# EAGLE board TK90X (EAGLE 7.4.0), part 1 of 2
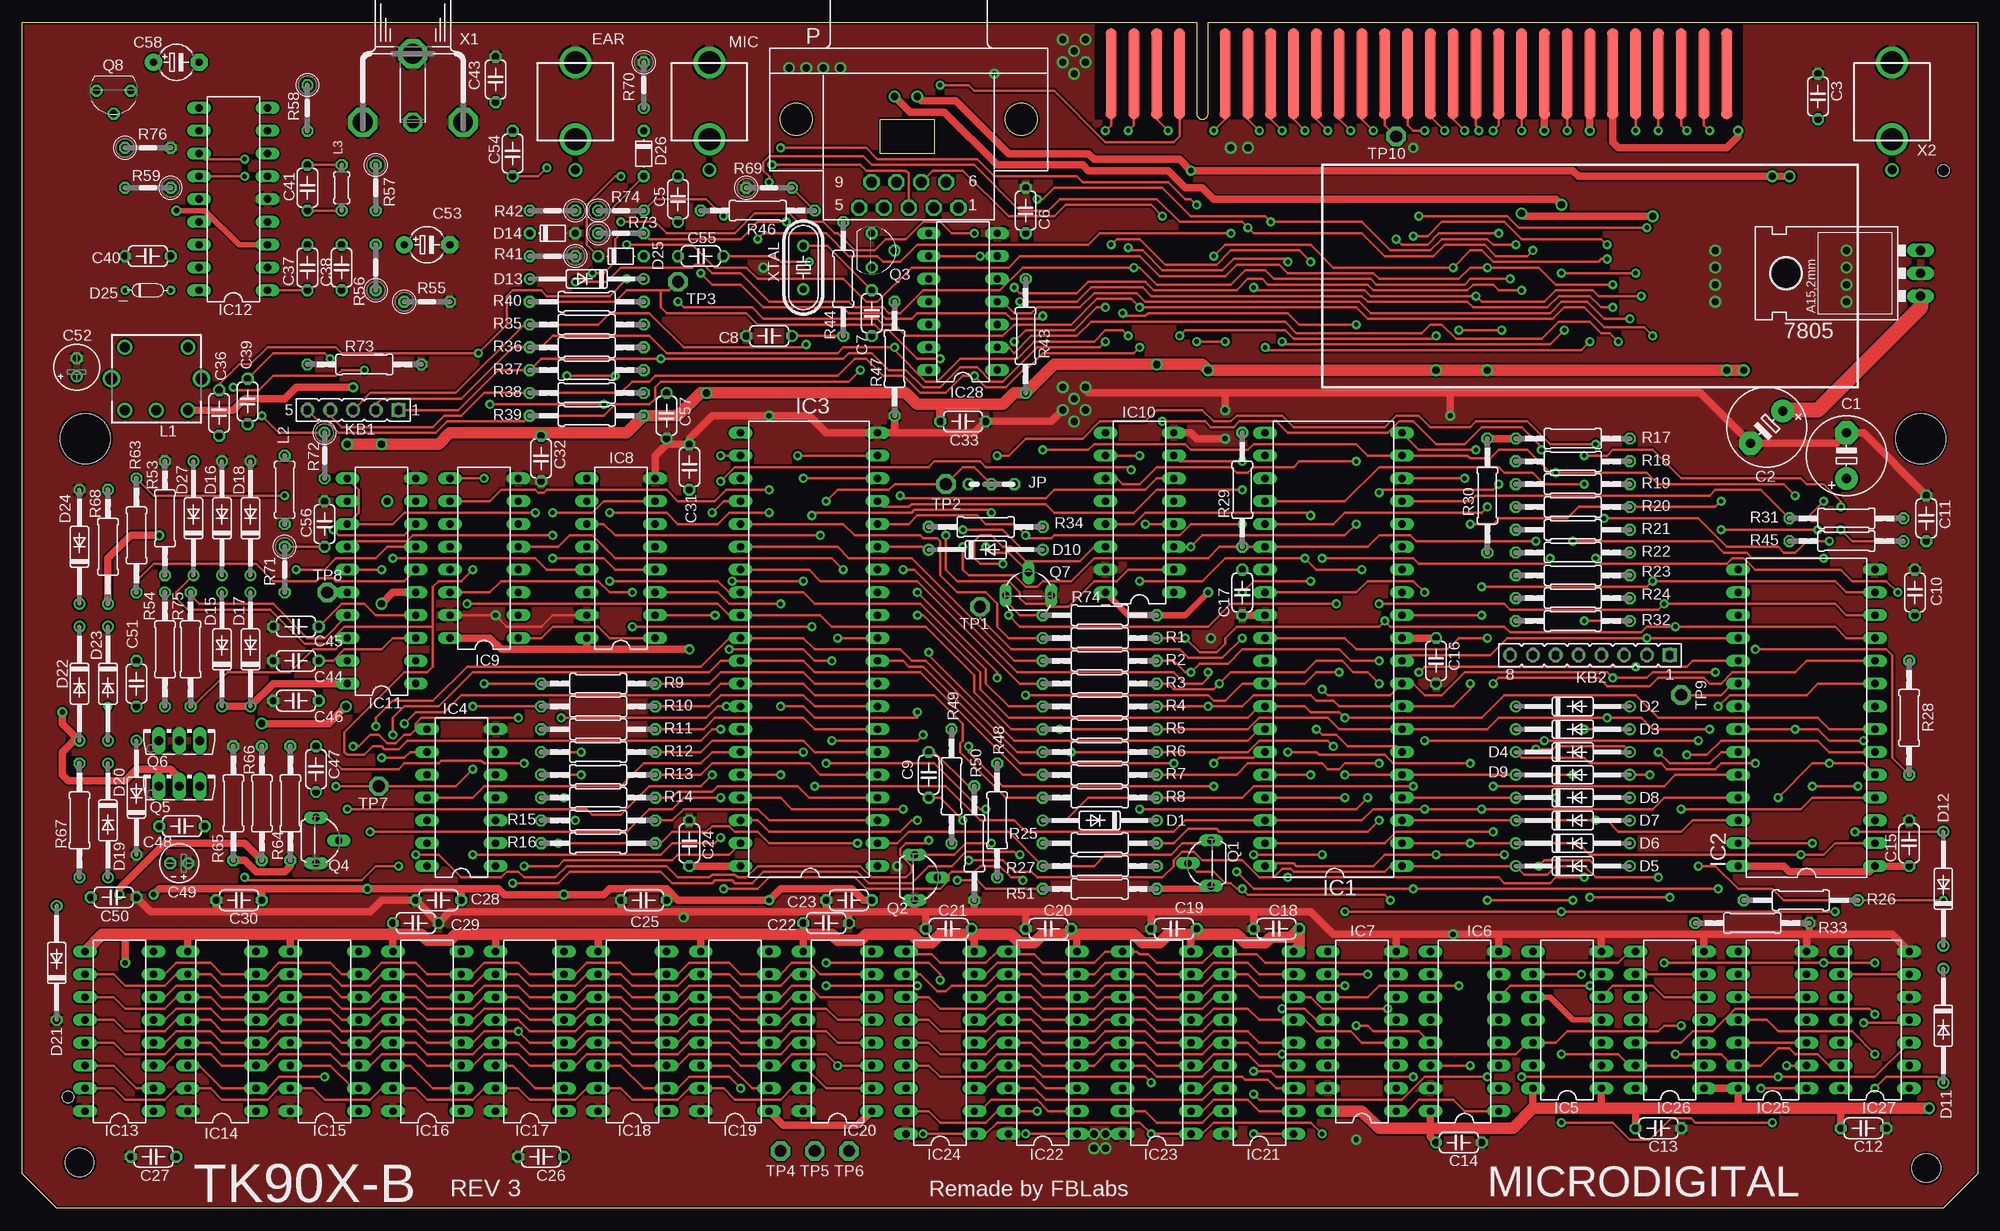
[diagram p5: board, top side]
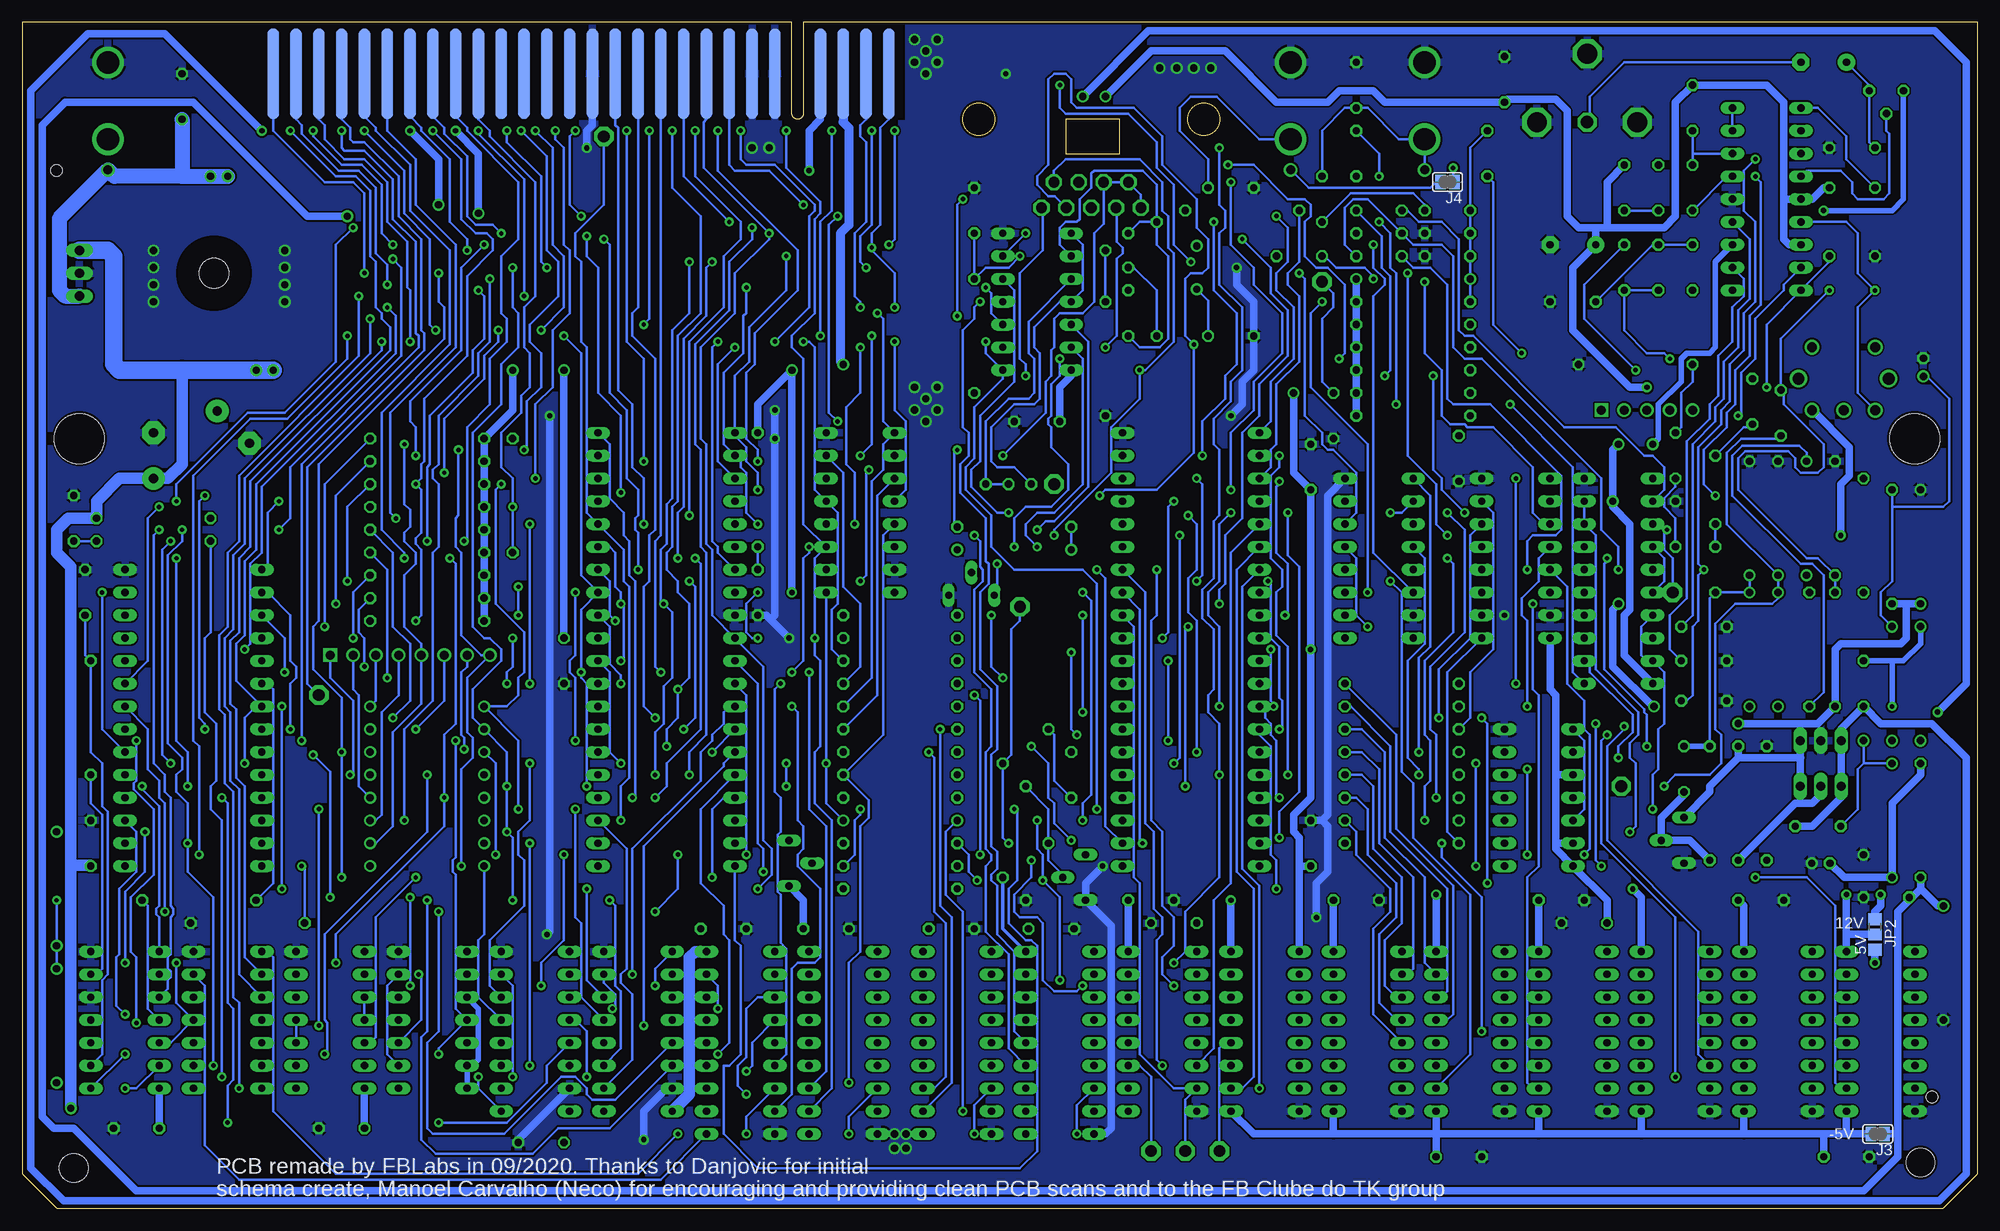
[diagram p6: board, bottom side, seen from below]

Size 217.81 x 132.08 mm. Coordinates in mm from the lower left corner, seen from the top.
Outline: 120.02,132.08 0,132.08 0,3.81 3.81,0 214,0 217.81,3.81 217.81,132.08 191.13,132.08
Copper layers (1*16): Top 0.035mm / dielectric 1.5mm / Bottom 0.035mm
Design rules "SparkFun(8mil) *": minimum track width 10mil, minimum drill 18mil, track to track 8mil, track to pad 8mil, pad to pad 8mil, via to via 8mil, smd to smd 8mil, copper to edge 10mil, drill to drill 8mil, minimum pad ring 10mil, minimum via ring 10mil, stop-mask expansion 4mil, vias tented up to drill 25mil, thermal gap 10mil
Net classes: 1 power: width 0.711 mm, drill 0.508 mm
Holes 3.2 mm at 6.35,5.08 212.09,4.45
Holes 5.59 mm at 6.99,85.72 211.46,85.72
Holes 1.3 mm at 5.08,12.38 214,115.57

## Footprints (pad centres in the part's own frame; a part is rotated, then mirrored left to right if it is on the bottom)
78XXL = drill 1.016 long: GND 0,-3.81; IN -2.54,-3.81; OUT 2.54,-3.81 | hole 3.302: 0,11.176
E5-8,5 = drill 1.016 pad 2.54: + -2.54,0 | drill 1.016 pad 2.54 octagon: - 2.54,0
C050-024X044 = drill 0.813 octagon: 1 -2.54,0; 2 2.54,0
E2-4 = drill 0.813 pad 1.27: + -1.016,0 | drill 0.813 pad 1.27 octagon: - 1.016,0
E2-5 = drill 0.813 pad 1.27: + -1.016,0 | drill 0.813 pad 1.27 octagon: - 1.016,0
E5-4 = drill 0.813 pad 1.905: + -2.54,0 | drill 0.813 pad 1.905 octagon: - 2.54,0
DO35-12 = drill 0.813: A 6.35,0; C -6.35,0
D-5 = drill 0.813 octagon: A 2.54,0; C -2.54,0
D200 = drill 0.5 octagon: A -2.54,0; K 2.54,0
MONO = drill 2.5: NC 0,4.76; RING 0,-3.81 | drill 1: TIP 0,8.175
DIL40 = drill 0.813 long: 1 -24.13,-7.62; 2 -21.59,-7.62; 3 -19.05,-7.62; 4 -16.51,-7.62; 5 -13.97,-7.62; 6 -11.43,-7.62; 7 -8.89,-7.62; 8 -6.35,-7.62; 9 -3.81,-7.62; 10 -1.27,-7.62; 11 1.27,-7.62; 12 3.81,-7.62; 13 6.35,-7.62; 14 8.89,-7.62; 15 11.43,-7.62; 16 13.97,-7.62; 17 16.51,-7.62; 18 19.05,-7.62; 19 21.59,-7.62; 20 24.13,-7.62; 21 24.13,7.62; 22 21.59,7.62; 23 19.05,7.62; 24 16.51,7.62; 25 13.97,7.62; 26 11.43,7.62; 27 8.89,7.62; 28 6.35,7.62; 29 3.81,7.62; 30 1.27,7.62; 31 -1.27,7.62; 32 -3.81,7.62; 33 -6.35,7.62; 34 -8.89,7.62; 35 -11.43,7.62; 36 -13.97,7.62; 37 -16.51,7.62; 38 -19.05,7.62; 39 -21.59,7.62; 40 -24.13,7.62
DIL28 = drill 0.813 long: 1 -16.51,-7.62; 2 -13.97,-7.62; 3 -11.43,-7.62; 4 -8.89,-7.62; 5 -6.35,-7.62; 6 -3.81,-7.62; 7 -1.27,-7.62; 8 1.27,-7.62; 9 3.81,-7.62; 10 6.35,-7.62; 11 8.89,-7.62; 12 11.43,-7.62; 13 13.97,-7.62; 14 16.51,-7.62; 15 16.51,7.62; 16 13.97,7.62; 17 11.43,7.62; 18 8.89,7.62; 19 6.35,7.62; 20 3.81,7.62; 21 1.27,7.62; 22 -1.27,7.62; 23 -3.81,7.62; 24 -6.35,7.62; 25 -8.89,7.62; 26 -11.43,7.62; 27 -13.97,7.62; 28 -16.51,7.62
DIL14 = drill 0.813 long: 1 -7.62,-3.81; 2 -5.08,-3.81; 3 -2.54,-3.81; 4 0,-3.81; 5 2.54,-3.81; 6 5.08,-3.81; 7 7.62,-3.81; 8 7.62,3.81; 9 5.08,3.81; 10 2.54,3.81; 11 0,3.81; 12 -2.54,3.81; 13 -5.08,3.81; 14 -7.62,3.81
DIL16 = drill 0.813 long: 1 -8.89,-3.81; 2 -6.35,-3.81; 3 -3.81,-3.81; 4 -1.27,-3.81; 5 1.27,-3.81; 6 3.81,-3.81; 7 6.35,-3.81; 8 8.89,-3.81; 9 8.89,3.81; 10 6.35,3.81; 11 3.81,3.81; 12 1.27,3.81; 13 -1.27,3.81; 14 -3.81,3.81; 15 -6.35,3.81; 16 -8.89,3.81
DIL20 = drill 0.813 long: 1 -11.43,-3.81; 2 -8.89,-3.81; 3 -6.35,-3.81; 4 -3.81,-3.81; 5 -1.27,-3.81; 6 1.27,-3.81; 7 3.81,-3.81; 8 6.35,-3.81; 9 8.89,-3.81; 10 11.43,-3.81; 11 11.43,3.81; 12 8.89,3.81; 13 6.35,3.81; 14 3.81,3.81; 15 1.27,3.81; 16 -1.27,3.81; 17 -3.81,3.81; 18 -6.35,3.81; 19 -8.89,3.81; 20 -11.43,3.81
DIL18 = drill 0.813 long: 1 -10.16,-3.81; 2 -7.62,-3.81; 3 -5.08,-3.81; 4 -2.54,-3.81; 5 0,-3.81; 6 2.54,-3.81; 7 5.08,-3.81; 8 7.62,-3.81; 9 10.16,-3.81; 10 10.16,3.81; 11 7.62,3.81; 12 5.08,3.81; 13 2.54,3.81; 14 0,3.81; 15 -2.54,3.81; 16 -5.08,3.81; 17 -7.62,3.81; 18 -10.16,3.81
SJ = smd 1.168 x 1.6: 1 -0.762,0; 2 0.762,0
03C = drill 0.813 octagon: 1 -1.905,0; 2 0.635,0; 3 3.175,0
B0R-JMP = smd 1.5 x 1.3: 1 0,1.7; 2 0,0; 3 0,-1.7
FE05-1 = drill 1 square: 1 -5.08,0 | drill 1: 2 -2.54,0; 3 0,0; 4 2.54,0; 5 5.08,0
FE08 = drill 1 square: 1 -8.89,0 | drill 1: 2 -6.35,0; 3 -3.81,0; 4 -1.27,0; 5 1.27,0; 6 3.81,0; 7 6.35,0; 8 8.89,0
COIL = drill 1.1: 1 -3.52,-3.52; 2 -3.52,3.52; 3 0,3.52; 4 3.52,3.52; 5 3.52,-3.52 | drill 1.3: S1 -5.02,0; S2 5.02,0
0207/7 = drill 0.813 octagon: 1 -3.81,0; 2 3.81,0
0204/5 = drill 0.813 octagon: 1 -2.54,0; 2 2.54,0
177-009-MALE = drill 1.194 pad 1.524 octagon: 1 -5.537,9.84; 2 -2.769,9.84; 3 0,9.84; 4 2.769,9.84; 5 5.537,9.84; 6 -4.153,6.997; 7 -1.384,6.997; 8 1.384,6.997; 9 4.153,6.997
TO92L = drill 0.813 long: 1 0,-2.54; 2 2.54,0; 3 0,2.54
TO92-CEB = drill 0.813 octagon: B 1.905,0; C -1.905,0; E 0,2.54
TO126AV = drill 1.016 long: B 2.286,-1.27; C 0,-1.27; E -2.286,-1.27
TO92-EBC = drill 0.813 octagon: B 0,2.54; C 1.905,0; E -1.905,0
0207/12 = drill 0.813 octagon: 1 -6.35,0; 2 6.35,0
0207/5V = drill 0.813 octagon: 1 -2.54,0; 2 2.54,0
P1-13 = drill 1.321 pad 2.159 octagon: 1 0,0
TK-EDGE = smd 1.27 x 10.16 bottom: 1A -10.16,-1.905; 2A -7.62,-1.905; 3A -5.08,-1.905; 4A -2.54,-1.905; 6A 2.54,-1.905; 7A 5.08,-1.905; 8A 7.62,-1.905; 9A 10.16,-1.905; 10A 12.7,-1.905; 11A 15.24,-1.905; 12A 17.78,-1.905; 13A 20.32,-1.905; 14A 22.86,-1.905; 15A 25.4,-1.905; 16A 27.94,-1.905; 17A 30.48,-1.905; 18A 33.02,-1.905; 19A 35.56,-1.905; 20A 38.1,-1.905; 21A 40.64,-1.905; 22A 43.18,-1.905; 23A 45.72,-1.905; 24A 48.26,-1.905; 25A 50.8,-1.905; 26A 53.34,-1.905; 27A 55.88,-1.905; 28A 58.42,-1.905 | smd 1.27 x 10.16: 1B -10.16,-1.905; 2B -7.62,-1.905; 3B -5.08,-1.905; 4B -2.54,-1.905; 6B 2.54,-1.905; 7B 5.08,-1.905; 8B 7.62,-1.905; 9B 10.16,-1.905; 10B 12.7,-1.905; 11B 15.24,-1.905; 12B 17.78,-1.905; 13B 20.32,-1.905; 14B 22.86,-1.905; 15B 25.4,-1.905; 16B 27.94,-1.905; 17B 30.48,-1.905; 18B 33.02,-1.905; 19B 35.56,-1.905; 20B 38.1,-1.905; 21B 40.64,-1.905; 22B 43.18,-1.905; 23B 45.72,-1.905; 24B 48.26,-1.905; 25B 50.8,-1.905; 26B 53.34,-1.905; 27B 55.88,-1.905; 28B 58.42,-1.905
TOBU3 = drill 1.397 octagon: PIN 0,-2.54 | drill 2.21 octagon: SHELL 5.588,-2.54; SHELL@1 -5.588,-2.54; SHELL@2 0,5.08
HC49/S = drill 0.813: 1 -2.413,0; 2 2.413,0

## Placement (x,y rotation side)
7805  7805  [78XXL]  207.65,104.14 90 top
C1  100u  [E5-8,5]  203.2,83.82 90 top
C2  100u  [E5-8,5]  194.31,87 225 top
C3  100n  [C050-024X044]  200.03,123.83 270 top
C5  100n  [C050-024X044]  73.03,112.39 90 top
C6  100p  [C050-024X044]  111.76,111.12 270 top
C7  33p  [C050-024X044]  94.61,99.69 270 top
C8  100p  [C050-024X044]  83.19,97.16 0 top
C9  100p  [C050-024X044]  100.97,48.26 270 top
C10  47p  [C050-024X044]  210.82,68.58 90 top
C11  100p  [C050-024X044]  212.09,76.83 90 top
C12  100n  [C050-024X044]  205.1,8.89 180 top
C13  100n  [C050-024X044]  182.25,8.89 180 top
C14  100n  [C050-024X044]  160.02,7.3 180 top
C15  100n  [C050-024X044]  210.19,40.64 90 top
C16  100n  [C050-024X044]  157.48,60.96 270 top
C17  100n  [C050-024X044]  135.89,68.58 270 top
C18  100n  [C050-024X044]  139.7,31.11 180 top
C19  100n  [C050-024X044]  128.27,31.11 180 top
C20  100n  [C050-024X044]  114.3,31.11 180 top
C21  100n  [C050-024X044]  103.19,31.11 180 top
C22  100n  [C050-024X044]  89.53,31.75 180 top
C23  100n  [C050-024X044]  92.08,34.29 180 top
C24  100n  [C050-024X044]  74.3,40.64 270 top
C25  100n  [C050-024X044]  69.22,34.29 180 top
C26  100n  [C050-024X044]  57.78,5.71 180 top
C27  100n  [C050-024X044]  14.61,5.71 180 top
C28  100n  [C050-024X044]  46.35,34.29 180 top
C29  100n  [C050-024X044]  43.81,31.75 180 top
C30  100n  [C050-024X044]  24.13,34.29 180 top
C31  100n  [C050-024X044]  74.3,82.55 270 top
C32  100n  [C050-024X044]  57.78,83.5 90 top
C33  100n  [C050-024X044]  104.78,87.63 180 top
C36  100n  [C050-024X044]  21.91,88.58 90 top
C37  10n  [C050-024X044]  31.75,104.78 270 top
C38  47p  [C050-024X044]  35.56,104.78 90 top
C39  4n7  [C050-024X044]  25.08,89.85 90 top
C40  47p  [C050-024X044]  13.97,106.05 0 top
C41  82p  [C050-024X044]  31.75,113.67 270 top
C43  100n  [C050-024X044]  52.7,125.73 270 top
C44  100p  [C050-024X044]  30.48,60.96 180 top
C45  100p  [C050-024X044]  30.48,64.77 180 top
C46  100p  [C050-024X044]  30.48,56.52 180 top
C47  100p  [C050-024X044]  32.7,48.9 270 top
C48  100n  [C050-024X044]  17.78,42.55 180 top
C49  1u  [E2-4]  17.46,38.42 180 top
C50  100n  [C050-024X044]  10.16,34.61 0 top
C51  100n  [C050-024X044]  12.7,58.42 90 top
C52  1u  [E2-5]  6.03,93.66 90 top
C53  100u  [E5-4]  45.09,107.31 0 top
C54  100n  [C050-024X044]  54.61,117.47 270 top
C55  100n  [C050-024X044]  75.56,106.05 0 top
C56  47p  [C050-024X044]  33.66,76.2 270 top
C57  1n  [C050-024X044]  71.75,88.27 270 top
C58  47u  [E5-4]  17.14,127.64 0 top
D1  1N4148  [DO35-12]  120.02,43.18 180 top
D2  1N4148  [DO35-12]  172.72,55.88 0 top
D3  1N4148  [DO35-12]  172.72,53.34 0 top
D4  1N4148  [DO35-12]  172.72,50.8 0 top
D5  1N4148  [DO35-12]  172.72,38.1 0 top
D6  1N4148  [DO35-12]  172.72,40.64 0 top
D7  1N4148  [DO35-12]  172.72,43.18 0 top
D8  1N4148  [DO35-12]  172.72,45.72 0 top
D9  1N4148  [DO35-12]  172.72,48.26 0 top
D10  1N4148  [DO35-12]  107.31,73.34 0 top
D11  1N4148  [DO35-12]  214,20.32 270 top
D12  1N4148  [DO35-12]  214,35.56 90 top
D13  1N4148  [DO35-12]  62.87,103.5 180 top
D14  1N4148  [D-5]  59.05,108.58 0 top
D15  1N4148  [DO35-12]  22.23,62.23 90 top
D16  1N4148  [DO35-12]  22.23,76.83 90 top
D17  1N4148  [DO35-12]  25.4,62.23 90 top
D18  1N4148  [DO35-12]  25.4,76.83 90 top
D19  1N4148  [DO35-12]  9.53,43.18 270 top
D20  1N4148  [DO35-12]  12.7,45.72 90 top
D21  5V  [DO35-12]  3.81,27.3 90 top
D22  1N4148  [DO35-12]  6.35,58.42 270 top
D23  1N4148  [DO35-12]  9.53,58.42 270 top
D24  12V  [DO35-12]  6.35,73.66 90 top
D25  1N4148  [D-5]  66.67,106.05 0 top
D25_  Varicap  [D200]  13.97,102.23 180 top
D26  1N4148  [D-5]  69.22,117.47 270 top
D27  1N4148  [DO35-12]  19.05,76.83 90 top
EAR  EAR  [MONO]  61.59,123.83 180 top
IC1  Z80  [DIL40]  146.05,62.23 90 top
IC2  ROM  [DIL28]  198.75,54.61 90 top
IC3  ULA TK90  [DIL40]  87.63,62.23 90 top
IC4  74LS74  [DIL14]  48.9,45.72 90 top
IC5  74LS74  [DIL14]  172.09,20.95 90 top
IC6  74LS157  [DIL16]  160.66,19.68 90 top
IC7  74LS157  [DIL16]  149.22,19.68 90 top
IC8  74LS157  [DIL16]  66.67,72.39 90 top
IC9  74LS157  [DIL16]  51.44,72.39 90 top
IC10  74LS365N  [DIL16]  124.46,77.47 90 top
IC11  LM1886  [DIL20]  40.01,69.85 90 top
IC12  LM1889  [DIL18]  23.5,112.39 90 top
IC13  4116  [DIL16]  10.79,19.68 90 top
IC14  4116  [DIL16]  22.23,19.68 90 top
IC15  4116  [DIL16]  33.66,19.68 90 top
IC16  4116  [DIL16]  45.09,19.68 90 top
IC17  4116  [DIL16]  56.52,19.68 90 top
IC18  4116  [DIL16]  67.94,19.68 90 top
IC19  4116  [DIL16]  79.38,19.68 90 top
IC20  4116  [DIL16]  90.81,19.68 90 top
IC21  4416  [DIL18]  137.79,18.41 90 top
IC22  4416  [DIL18]  113.67,18.41 90 top
IC23  4416  [DIL18]  126.36,18.41 90 top
IC24  4416  [DIL18]  102.23,18.41 90 top
IC25  74LS00  [DIL14]  194.94,20.95 90 top
IC26  74LS00  [DIL14]  183.51,20.95 90 top
IC27  74LS32  [DIL14]  206.38,20.95 90 top
IC28  74LS04  [DIL14]  104.78,100.97 90 top
J3  [SJ]  11.11,8.26 180 bottom
J4  [SJ]  59.05,114.3 180 bottom
JP  [03C]  108.58,80.64 180 top
JP2  0R-JUMPB  [B0R-JMP]  11.43,30.48 180 bottom
KB1  TECLADO  [FE05-1]  36.83,88.9 180 top
KB2  TECLADO  [FE08]  174.62,61.59 180 top
L1  [COIL]  14.92,92.39 180 top
L2  27u  [0207/7]  29.21,80.01 90 top
L3  [0204/5]  35.56,113.67 90 top
MIC  MIC  [MONO]  76.52,123.83 180 top
P  JOYSTICK  [177-009-MALE]  98.74,121.28 180 top
Q1  BC548  [TO92L]  132.4,38.42 180 top
Q2  BC548  [TO92L]  99.38,36.83 0 top
Q3  BF494  [TO92-CEB]  94.61,106.68 270 top
Q4  BC548  [TO92L]  32.7,40.96 0 top
Q5  BD139  [TO126AV]  17.46,48.26 0 top
Q6  BD136  [TO126AV]  17.46,53.34 0 top
Q7  BC548  [TO92L]  112.08,68.26 90 top
Q8  2N4401  [TO92-EBC]  10.16,124.46 180 top
R1  470  [0207/12]  120.02,63.5 0 top
R2  470  [0207/12]  120.02,60.96 0 top
R3  470  [0207/12]  120.02,58.42 0 top
R4  470  [0207/12]  120.02,55.88 0 top
R5  470  [0207/12]  120.02,53.34 0 top
R6  470  [0207/12]  120.02,50.8 0 top
R7  470  [0207/12]  120.02,48.26 0 top
R8  470  [0207/12]  120.02,45.72 0 top
R9  470  [0207/12]  64.14,58.42 180 top
R10  470  [0207/12]  64.14,55.88 180 top
R11  470  [0207/12]  64.14,53.34 180 top
R12  470  [0207/12]  64.14,50.8 180 top
R13  470  [0207/12]  64.14,48.26 180 top
R14  470  [0207/12]  64.14,45.72 180 top
R15  470  [0207/12]  64.14,43.18 180 top
R16  220  [0207/12]  64.14,40.64 0 top
R17  10K  [0207/12]  172.72,85.72 180 top
R18  10K  [0207/12]  172.72,83.19 180 top
R19  10K  [0207/12]  172.72,80.64 180 top
R20  10K  [0207/12]  172.72,78.11 180 top
R21  10K  [0207/12]  172.72,75.56 180 top
R22  10K  [0207/12]  172.72,73.03 180 top
R23  10K  [0207/12]  172.72,70.48 180 top
R24  10K  [0207/12]  172.72,67.94 180 top
R25  470  [0207/12]  120.02,40.64 0 top
R26  470  [0207/12]  198.12,34.29 180 top
R27  470  [0207/12]  120.02,38.1 180 top
R28  470  [0207/12]  210.19,54.61 90 top
R29  1M  [0207/12]  135.89,80.01 90 top
R30  4K7  [0207/12]  163.19,79.38 270 top
R31  4K7  [0207/12]  203.2,76.83 180 top
R32  4K7  [0207/12]  172.72,65.41 0 top
R33  1K  [0207/12]  192.72,31.75 0 top
R34  470  [0207/12]  107.31,75.88 180 top
R35  4K7  [0207/12]  62.87,98.42 180 top
R36  4K7  [0207/12]  62.87,95.89 180 top
R37  4K7  [0207/12]  62.87,93.34 180 top
R38  4K7  [0207/12]  62.87,90.81 180 top
R39  4K7  [0207/12]  62.87,88.27 180 top
R40  3K3  [0207/12]  62.87,100.97 0 top
R41  680  [0207/5V]  59.05,106.05 180 top
R42  100  [0207/5V]  59.05,111.12 180 top
R43  2K2  [0207/12]  111.76,97.16 270 top
R44  2K2  [0207/12]  91.44,103.5 270 top
R45  470  [0207/12]  203.2,74.3 0 top
R46  10K  [0207/12]  81.92,111.12 180 top
R47  100  [0207/12]  97.16,94.61 90 top
R48  220  [0207/12]  108.58,43.18 270 top
R49  1K  [0207/12]  103.5,46.99 90 top
R50  1K  [0207/12]  106.05,40.64 90 top
R51  4K7  [0207/12]  120.02,35.56 0 top
R53  47K  [0207/12]  15.88,76.83 90 top
R54  39K  [0207/12]  15.88,62.23 90 top
R55  1K  [0207/5V]  45.09,100.97 0 top
R56  1K  [0207/5V]  39.37,104.78 90 top
R57  220  [0207/5V]  39.37,113.67 270 top
R58  220  [0207/5V]  31.75,122.56 270 top
R59  470  [0207/5V]  13.97,113.67 180 top
R63  4K7  [0207/12]  12.7,74.93 270 top
R64  4K7  [0207/12]  29.84,45.09 90 top
R65  1K  [0207/12]  23.5,45.09 90 top
R66  470  [0207/12]  26.67,45.09 90 top
R67  470  [0207/12]  6.35,43.18 90 top
R68  100  [0207/12]  9.53,73.66 90 top
R69  100  [0207/5V]  83.19,113.67 0 top
R70  100  [0207/5V]  69.22,125.09 270 top
R71  3K3  [0207/5V]  29.21,71.12 270 top
R72  10K  [0207/5V]  33.66,83.82 270 top
R73  10K  [0207/5V]  66.67,108.58 0 top
R73_  3K3  [0207/12]  38.1,93.98 0 top
R74  10K  [0207/5V]  66.67,111.12 0 top
R74_  470  [0207/12]  120.02,66.04 0 top
R75  10K  [0207/12]  18.73,62.23 90 top
R76  75  [0207/5V]  13.97,118.11 0 top
TP1  TPSQPAD1-13  [P1-13]  106.68,66.99 180 top
TP2  TPSQPAD1-13  [P1-13]  102.87,80.64 0 top
TP3  TPSQPAD1-13  [P1-13]  73.03,103.19 0 top
TP4  TPSQPAD1-13  [P1-13]  84.45,6.35 180 top
TP5  TPSQPAD1-13  [P1-13]  88.27,6.35 180 top
TP6  TPSQPAD1-13  [P1-13]  92.08,6.35 180 top
TP7  TPSQPAD1-13  [P1-13]  39.69,46.99 180 top
TP8  TPSQPAD1-13  [P1-13]  33.97,68.58 0 top
TP9  TPSQPAD1-13  [P1-13]  184.78,57.15 0 top
TP10  TPSQPAD1-13  [P1-13]  153.03,119.38 180 top
U$1  TK90_EDGE  [TK-EDGE]  131.44,128.27 0 top
X1  RCA2PINA1  [TOBU3]  43.5,123.51 0 top
X2  POWER  [MONO]  208.28,123.83 180 top
XTAL  14.3044MHz  [HC49/S]  87,104.78 90 top

## Tracks (layer width: path | path; a pad name or v marks a point on that pad's centre or on a via)
!A!/B  (via drill 0.5)
  Top 0.305: IC27.3 206.38,14.61 v195.58,14.61 v167,14.61 | IC6.1 160.66,10.79 159.38,12.06 155.57,12.06 154.31,10.79 IC7.1
  Bottom 0.305: v167,14.61 167,13.34 IC6.1 | R45.1 196.85,64.14 197.49,63.5 197.49,55.24 196.22,53.98 196.22,47.62 196.85,46.99 196.85,44.45 195.58,43.18 v195.58,14.61
!BUSAK  (via drill 0.5)
  Top 0.305: v174.62,96.52 173.67,95.57 138.75,95.57 v138.43,95.89
  Bottom 0.305: U$1.26A 184.78,121.28 184.15,120.65 184.15,119.06 181.93,116.84 179.71,116.84 177.16,114.3 177.16,109.86 174.94,107.63 174.94,102.55 174.62,102.23 v174.62,96.52 | v138.43,95.89 140.34,93.98 140.34,83.19 IC1.23
!BUSRQ  (via drill 0.5)
  Top 0.305: v163.19,78.11 162.56,77.47 147.32,77.47 146.05,76.2 IC1.25
  Bottom 0.305: U$1.19A 167,121.28 165.74,120.02 165.74,119.38 160.66,114.3 160.66,101.6 161.93,100.33 161.93,95.89 161.29,95.25 161.29,91.44 162.24,90.49 162.24,88.58 164.47,86.36 164.47,82.55 163.19,81.28 v163.19,78.11 R30.2
!CAS0  (via drill 0.5)
  Top 0.305: v100.33,8.26 IC24.1 107.31,8.26 108.58,9.53 124.46,9.53 v125.73,8.26 IC23.1 131.44,8.26 132.72,9.53 143.51,9.53 v144.78,8.26
  Bottom 0.305: IC24.16 100.33,11.43 v100.33,8.26 | v144.78,8.26 149.22,3.81 182.88,3.81 189.87,10.79 189.87,27.94 190.5,28.57 IC25.8 | IC23.16 125.73,10.16 v125.73,8.26
!CAS1  (via drill 0.5)
  Top 0.305: v111.76,8.26 IC22.1 | IC22.16 112.71,13.34 113.98,12.06 131.44,12.06 132.72,13.34 IC21.16 | v137.16,8.26 IC21.1
  Bottom 0.305: IC22.16 111.76,11.43 v111.76,8.26 | IC21.16 137.16,10.16 v137.16,8.26 | IC21.1 146.69,3.17 193.68,3.17 197.49,6.99 197.49,24.77 IC25.6
!HALT  (via drill 0.5)
  Top 0.305: U$1.15B 156.84,121.6 v158.43,120.02 | v160.66,81.28 IC1.18
  Bottom 0.305: v158.43,120.02 158.43,119.06 157.48,118.11 157.48,107.31 156.84,106.68 156.84,99.69 158.75,97.79 158.75,91.44 160.66,89.53 v160.66,81.28
!IORQ  (via drill 0.5)
  Top 0.305: v149.86,45.72 148.59,44.45 v124.46,44.45 | IC1.20 155.57,84.45 v161.93,84.45 | v162.24,120.02 162.24,120.33 161.93,120.65 U$1.17B
  Bottom 0.305: IC1.20 152.4,85.09 152.4,79.06 150.81,77.47 150.81,74.93 150.18,74.3 150.18,70.48 149.54,69.85 149.54,46.04 v149.86,45.72 | v124.46,44.45 124.46,43.81 125.09,43.18 125.09,39.37 R27.1 | v161.93,84.45 161.61,84.77 161.61,89.85 160.02,91.44 160.02,95.25 161.29,96.52 161.29,98.42 158.12,101.6 158.12,105.41 159.38,106.68 159.38,117.16 v162.24,120.02
!IORQGE  (via drill 0.5)
  Top 0.305: IC3.2 97.47,40.64 98.74,41.91 109.86,41.91 R27.2 119.38,38.1 120.65,39.37 127.95,39.37 129.22,40.64 132.08,40.64 Q1.1 | v148.59,76.2 147.32,74.93 131.44,74.93 v130.18,73.66 | v132.08,59.69 132.08,59.05 131.44,58.42 129.54,58.42 128.27,59.69 110.81,59.69 99.38,71.12 v98.11,71.12
  Bottom 0.305: U$1.13A 151.76,120.65 151.45,120.33 151.45,91.12 149.86,89.53 149.86,82.55 148.59,81.28 v148.59,76.2 | v130.18,73.66 130.18,73.03 130.81,72.39 130.81,60.96 v132.08,59.69 | v98.11,71.12 97.16,70.17 97.16,42.55 IC3.2
!KBD  (via drill 0.5)
  Top 0.305: IC3.10 98.11,60.96 98.74,60.33 100.33,60.33 111.12,49.53 v128.27,49.53
  Bottom 0.305: D1.C 128.27,45.09 v128.27,49.53 IC10.1
!M1  (via drill 0.5)
  Top 0.305: U$1.24B v179.71,120.02 | v171.77,97.79 170.18,96.2 140.65,96.2 v140.34,96.52
  Bottom 0.305: v179.71,120.02 175.26,115.57 175.26,110.81 172.4,107.95 172.4,98.42 v171.77,97.79 | v140.34,96.52 140.97,95.89 140.97,74.3 140.34,73.66 140.34,73.03 IC1.27
!MREQ  (via drill 0.5)
  Top 0.305: IC27.4 209.55,20.95 209.23,20.64 v205.1,20.64 | v205.1,52.07 201.29,52.07 200.03,53.34 v197.49,53.34 IC2.22 | v113.67,84.45 118.75,84.45 119.38,85.09 129.54,85.09 130.18,84.45 136.53,84.45 137.16,85.09 148.59,85.09 149.86,83.82 IC1.19 160.97,83.82 161.29,83.5 163.51,83.5 164.47,84.45 167.64,84.45 170.18,81.92 v170.81,81.92 180.97,81.92 182.25,80.64 196.22,80.64 v197.49,79.38 | v164.78,97.79 v160.02,97.79 | v160.66,120.02 159.38,121.28 U$1.16B
  Bottom 0.305: v205.1,20.64 205.1,27.94 205.74,28.57 205.74,34.61 203.2,37.15 203.2,44.45 205.42,46.67 205.42,47.31 205.1,47.62 v205.1,52.07 | R34.1 113.98,76.2 113.98,84.14 v113.67,84.45 | v197.49,53.34 197.49,53.98 198.12,54.61 198.12,78.74 v197.49,79.38 | v170.81,81.92 170.81,87.95 166.37,92.39 166.37,94.93 164.78,96.52 v164.78,97.79 | v160.02,97.79 157.48,100.33 157.48,106.05 158.75,107.31 158.75,118.11 v160.66,120.02
!NMI  (via drill 0.5)
  Top 0.305: v200.66,78.74 198.75,76.83 R31.2 193.68,80.01 188.59,80.01 187.96,79.38 161.93,79.38 161.29,78.74 IC1.17 | v180.97,109.22 166.69,109.22 165.42,110.49 v155.57,110.49 | v156.21,120.02 154.94,120.02 154.31,120.65 U$1.14B
  Bottom 0.305: v200.66,78.74 200.66,80.64 192.72,88.58 188.59,88.58 182.88,94.3 182.88,107.31 v180.97,109.22 | v155.57,110.49 156.84,111.76 156.84,119.38 v156.21,120.02
!RAS  (via drill 0.5)
  Top 0.305: IC24.5 107.31,18.41 108.58,19.68 112.39,19.68 113.67,18.41 IC22.5 119.38,18.41 120.65,19.68 125.09,19.68 126.36,18.41 IC23.5 131.44,18.41 132.72,19.68 136.53,19.68 137.79,18.41 IC21.5 | IC27.9 IC27.6 | R28.1 208.28,50.16 208.28,61.59 207.65,62.23 v193.04,62.23 | v177.16,100.33 175.9,100.33 174.62,101.6 171.13,101.6 169.86,100.33 161.61,100.33 160.97,100.97 149.86,100.97 149.22,101.6 125.73,101.6 124.78,102.55 119.06,102.55 117.47,100.97 v111.12,100.97
  Bottom 0.305: IC27.6 209.55,26.04 208.91,26.67 208.91,43.81 210.19,45.09 R28.1 | v193.04,62.23 192.41,62.87 192.41,71.75 191.13,73.03 191.13,80.33 176.21,95.25 176.21,99.38 v177.16,100.33 | IC24.5 107.31,19.68 107.31,28.57 109.22,30.48 109.22,35.88 109.86,36.51 109.86,37.15 109.22,37.78 109.22,39.69 109.86,40.32 109.86,50.48 109.22,51.12 109.22,58.1 111.12,60.01 111.12,68.58 110.17,69.53 110.17,71.75 110.49,72.07 110.49,76.83 113.35,79.69 113.35,82.87 112.39,83.82 112.39,86.36 113.03,87 113.03,97.79 111.76,99.06 111.76,100.33 v111.12,100.97
!RD  (via drill 0.5)
  Top 0.305: IC25.2 v196.53,15.88 | v199.39,40.64 IC2.27 | v200.03,75.56 v189.23,75.56 | IC3.17 95.89,78.11 98.74,78.11 99.06,78.42 113.98,78.42 114.94,77.47 123.83,77.47 126.36,80.01 v135.89,80.01 | v176.53,105.73 175.9,105.73 175.58,105.41 163.83,105.41 162.56,106.68 161.29,106.68 v159.38,104.78 146.05,104.78 143.51,107.31 133.99,107.31 v132.72,106.05 | U$1.18B 164.47,120.65 v163.83,120.02
  Bottom 0.305: v196.53,15.88 196.53,34.61 199.39,37.47 v199.39,40.64 199.39,45.09 200.66,46.35 200.66,48.26 200.03,48.9 200.03,50.16 201.61,51.75 201.61,72.71 200.03,74.3 v200.03,75.56 | v189.23,75.56 187.96,76.83 187.96,82.55 175.58,94.93 175.58,104.78 v176.53,105.73 | v135.89,80.01 135.89,81.92 137.16,83.19 137.16,84.77 138.43,86.04 IC1.21 138.43,92.71 136.84,94.3 136.84,98.11 132.72,102.23 v132.72,106.05 | v163.83,120.02 163.83,118.75 160.02,114.94 160.02,105.41 v159.38,104.78
!RESET  (via drill 0.5)
  Top 0.305: v104.78,73.66 104.78,71.12 105.41,70.48 110.49,70.48 111.76,69.22 113.03,69.22 113.67,69.85 116.84,69.85 119.38,72.39 132.08,72.39 133.35,73.66 R29.1 IC1.26 149.86,73.66 151.13,74.93 154.62,74.93 155.26,74.3 v168.59,74.3
  Bottom 0.305: IC28.13 99.69,94.61 99.69,80.64 102.87,77.47 104.78,77.47 106.05,76.2 106.05,74.93 v104.78,73.66 | R29.1 C17.1 | U$1.20A 169.54,121.6 168.28,120.33 168.28,120.02 162.56,114.3 162.56,107.95 164.47,106.05 164.47,99.69 163.83,99.06 163.83,96.52 165.74,94.61 165.74,89.53 168.28,87 168.28,74.61 v168.59,74.3
!RFSH  (via drill 0.5)
  Top 0.305: IC26.2 IC26.13 179.07,15.88 177.8,17.14 v171.45,17.14 | v186.69,52.07 v169.54,52.07 v156.21,52.07 | U$1.25B v182.25,120.02 | v156.21,68.58 154.94,69.85 149.86,69.85 148.59,68.58 IC1.28
  Bottom 0.305: v171.45,17.14 171.45,17.78 IC5.11 169.54,22.23 169.54,37.15 169.86,37.47 169.86,38.73 169.54,39.05 v169.54,52.07 | v182.25,120.02 182.25,118.11 181.93,117.79 179.71,117.79 176.53,114.62 176.53,110.17 173.99,107.63 173.99,97.47 173.67,97.16 173.67,95.89 186.69,82.87 v186.69,52.07 | v156.21,52.07 156.21,59.05 156.84,59.69 156.84,60.96 156.21,61.59 v156.21,68.58
!ROMCS
  Top 0.305: IC2.20 190.5,58.42 189.23,57.15 TP9.1
  Bottom 0.305: TP9.1 186.06,58.42 186.06,82.55 173.04,95.57 173.04,97.47 173.35,97.79 173.35,107.95 175.9,110.49 175.9,114.94 179.71,118.75 180.97,118.75 181.29,119.06 181.29,120.33 182.25,121.28 U$1.25A | IC2.20 190.5,58.42 189.87,57.78 189.87,36.2 R26.2
!ULAINT  (via drill 0.5)
  Top 0.305: v78.11,35.56 81.92,35.56 83.19,36.83 92.71,36.83 93.98,35.56 102.23,35.56 103.19,36.51 103.19,37.15 103.5,37.47 106.05,37.47 106.68,38.1 108.9,38.1 110.17,36.83 111.12,36.83 v111.44,36.51
  Bottom 0.305: IC3.34 80.01,52.7 78.74,51.44 78.74,39.37 78.11,38.73 v78.11,35.56 | v111.44,36.51 112.39,37.47 112.39,39.37 R25.1
!VCAS
  Top 0.305: IC13.15 10.16,13.34 11.43,12.06 15.88,12.06 17.14,13.34 IC14.15 20.95,13.34 22.23,12.06 27.3,12.06 28.57,13.34 IC15.15 32.38,13.34 33.66,12.06 38.73,12.06 40.01,13.34 IC16.15 43.81,13.34 45.09,12.06 50.16,12.06 51.44,13.34 IC17.15 55.24,13.34 56.52,12.06 61.59,12.06 62.87,13.34 IC18.15 66.67,13.34 67.94,12.06 73.03,12.06 74.3,13.34 IC19.15 78.11,13.34 79.38,12.06 84.45,12.06 85.72,13.34 IC20.15
  Bottom 0.305: TP5.1 88.27,12.06 IC20.15 89.53,13.34 93.34,17.14 93.34,36.2 93.98,36.83 93.98,64.77 IC3.12
!VRAS  (via drill 0.5)
  Top 0.305: IC13.4 15.88,18.41 17.14,19.68 20.95,19.68 22.23,18.41 IC14.4 27.3,18.41 28.57,19.68 34.29,19.68 35.56,18.41 IC15.4 38.73,18.41 40.01,19.68 43.81,19.68 45.09,18.41 IC16.4 50.16,18.41 51.44,19.68 v55.24,19.68 56.52,18.41 IC17.4 61.59,18.41 62.87,19.68 66.67,19.68 67.94,18.41 IC18.4 73.03,18.41 74.3,19.68 78.74,19.68 80.01,18.41 IC19.4 84.45,18.41 85.72,19.68 89.53,19.68 90.81,18.41 IC20.4 | v59.69,40.64 R16.2 71.12,40.64 72.39,41.91 76.2,41.91 76.83,42.55 78.74,42.55 79.38,41.91 81.92,41.91 83.19,40.64 v93.03,40.64
  Bottom 0.305: v55.24,19.68 55.24,34.61 59.69,39.05 v59.69,40.64 | TP4.1 84.45,17.78 83.82,18.41 IC19.4 | v93.03,40.64 93.34,40.96 93.34,66.67 IC3.13
!VWR  (via drill 0.5)
  Top 0.305: IC13.3 15.88,15.88 17.14,17.14 20.95,17.14 22.23,15.88 IC14.3 27.3,15.88 28.57,17.14 34.29,17.14 35.56,15.88 IC15.3 38.73,15.88 40.01,17.14 43.81,17.14 45.09,15.88 IC16.3 50.16,15.88 51.44,17.14 55.24,17.14 56.52,15.88 IC17.3 61.59,15.88 62.87,17.14 66.67,17.14 67.94,15.88 IC18.3 73.03,15.88 74.3,17.14 78.74,17.14 80.01,15.88 IC19.3 84.45,15.88 85.72,17.14 89.53,17.14 v90.81,15.88 IC20.3
  Bottom 0.305: TP6.1 92.08,14.61 93.34,15.88 IC20.3 | v90.81,15.88 91.44,16.51 91.44,29.84 90.81,30.48 90.81,32.38 91.76,33.34 91.76,41.91 92.71,42.86 92.71,68.58 IC3.14
!WAIT  (via drill 0.5)
  Top 0.305: R32.2 v173.99,65.41 | v172.09,120.02 U$1.21B | v173.99,80.64 169.54,80.64 168.28,81.92 165.1,81.92 164.47,82.55 151.13,82.55 147.32,78.74 IC1.24
  Bottom 0.305: v173.99,65.41 173.35,66.04 173.35,73.34 173.99,73.98 173.99,74.61 173.35,75.25 173.35,80.01 v173.99,80.64 173.35,81.28 173.35,82.87 173.04,83.19 173.04,90.17 168.28,94.93 168.28,103.82 165.42,106.68 165.42,107.95 166.05,108.58 167.32,108.58 168.91,110.17 168.91,116.84 v172.09,120.02
!WR  (via drill 0.5)
  Top 0.305: IC24.4 107.31,15.88 108.58,17.14 112.39,17.14 113.67,15.88 IC22.4 119.38,15.88 120.65,17.14 125.09,17.14 126.36,15.88 IC23.4 131.44,15.88 132.72,17.14 136.53,17.14 137.79,15.88 IC21.4 | IC25.1 v193.68,13.34 | v180.34,101.6 175.58,101.6 174.94,102.23 170.81,102.23 169.54,100.97 162.56,100.97 v161.93,101.6 150.18,101.6 149.54,102.23 137.48,102.23 v137.16,102.55 | IC3.16 98.74,76.2 99.69,77.15 106.36,77.15 107.31,76.2 110.49,76.2 v111.76,74.93 | v111.76,74.93 112.08,74.61 114.62,74.61 114.94,74.93 128.91,74.93 130.18,76.2 v135.89,76.2 | U$1.19B v167,120.02 | v111.76,74.93 112.08,74.93
  Bottom 0.305: v193.68,13.34 193.68,22.86 194.31,23.5 194.31,46.35 195.26,47.31 195.26,54.93 195.9,55.56 195.9,63.82 194.94,64.77 194.94,73.03 193.68,74.3 193.68,81.6 180.34,94.93 v180.34,101.6 | IC24.4 107.95,17.78 107.95,28.26 110.49,30.8 110.49,38.1 109.86,38.73 109.86,39.37 110.49,40.01 110.49,50.8 109.86,51.44 109.86,57.78 111.76,59.69 111.76,68.9 110.81,69.85 110.81,71.12 111.12,71.44 111.12,74.3 v111.76,74.93 | v135.89,76.2 137.16,77.47 137.16,81.92 137.79,82.55 137.79,83.19 IC1.22 139.7,85.09 139.7,93.03 137.48,95.25 137.48,99.38 137.16,99.69 v137.16,102.55 | v167,120.02 167,119.7 161.93,114.62 v161.93,101.6
+5V  (via drill 0.6, 0.8)
  Top 0.61: IC5.10 170.18,23.5 172.72,20.95 IC5.4 | v17.14,111.12 20.32,111.12 24.13,107.31 IC12.3
  Top 0.711: IC10.16 123.19,66.04 R74_.2 129.54,66.04 v132.08,68.58 | R51.2 132.08,35.56 Q1.3
  Top 0.813: R30.1 R17.2 | IC1.11 C16.1 | IC14.9 18.41,30.48 | IC15.9 29.84,30.48 | IC16.9 41.27,30.48 C29.2 | IC17.9 52.7,30.48 | IC18.9 64.14,30.48 | IC19.9 75.56,30.48 | IC20.9 87,30.48 C22.2 | C21.1 105.73,30.8 105.41,30.48 106.05,29.84 IC24.9 | IC22.9 117.47,30.48 | C20.1 116.84,30.48 | IC23.9 130.18,30.48 | C15.1 IC2.1 205.74,37.47 196.85,37.47 196.22,38.1 IC2.28 | IC3.40 C24.2 | IC11.20 27.94,58.42 D17.C D15.C | IC9.16 52.07,63.5 53.34,62.23 62.87,62.23 | 62.87,62.23 v74.3,62.23 | IC8.16 62.87,62.23 | IC6.16 156.84,8.89 156.84,7.94 C14.2 | C12.2 202.56,11.11 | C13.2 179.71,11.11 | IC5.14 168.28,11.11 | 191.13,11.11 IC25.14 IC26.1 | IC5.1 175.9,11.11 | v11.43,27.3 11.43,30.48
  Top 1.016: 102.23,89.53 C33.2
  Top 1.27: IC13.9 8.89,30.48 11.43,30.48 18.41,30.48 29.84,30.48 41.27,30.48 44.45,30.48 45.09,29.84 47.62,29.84 48.26,30.48 52.7,30.48 64.14,30.48 75.56,30.48 87,30.48 90.17,30.48 90.81,29.84 93.34,29.84 93.98,30.48 99.06,30.48 100.01,29.53 101.28,29.53 102.23,30.48 105.41,30.48 110.17,30.48 111.12,29.53 112.71,29.53 113.67,30.48 116.84,30.48 117.47,30.48 123.83,30.48 124.78,29.53 126.68,29.53 127.64,30.48 130.18,30.48 130.81,30.48 | 130.81,30.48 135.25,30.48 136.21,29.53 138.43,29.53 139.06,30.16 141.29,30.16 C18.1 142.24,29.21 IC21.9 | IC7.16 149.22,10.79 151.13,8.89 156.84,8.89 166.05,8.89 168.28,11.11 175.9,11.11 179.71,11.11 191.13,11.11 202.56,11.11 v212.41,11.11 | v36.2,85.09 v40.01,85.09 46.35,85.09 47.62,86.36 57.78,86.36 | C19.1 130.81,30.48 | 57.78,86.36 67.31,86.36 R39.1 73.03,88.27 75.56,90.81 v76.2,90.81 98.42,90.81 99.69,89.53 102.23,89.53 109.22,89.53 110.49,90.81 R43.2 114.94,93.98 v126.36,93.98 131.44,93.98 v132.08,93.34 v157.48,93.34 v163.19,93.34 v189.87,93.34 v191.77,93.34 | C32.2 57.78,86.36
  Bottom 0.406: R48.2 108.58,31.11 IC24.9
  Bottom 0.61: v36.2,85.09 35.56,85.72 35.56,89.53 33.02,92.08 33.02,94.61 32.38,95.25 29.84,95.25 29.21,95.89 29.21,105.41 IC12.3 | IC5.10 167,22.23 167,16.51 167.64,15.88 IC5.13 IC5.14 | Q8.C 8.26,112.39 9.53,111.12 v17.14,111.12
  Bottom 0.813: R39.1 R38.1 R37.1 R36.1 R35.1 R40.2 D13.C | IC28.14 100.97,92.71 102.23,91.44 C33.2 | R29.2 135.89,89.53 v132.08,93.34 v132.08,68.58 | R32.1 R24.2 R23.2 R22.2 R21.2 R20.2 R19.2 R18.2 R17.2 163.19,88.9 v163.19,93.34 | C16.1 v157.48,93.34 | 210.26,38.18 C15.1 | IC27.14 C12.2 | C13.2 IC26.14 | IC19.9 75.56,38.1 | 75.56,38.1 75.56,41.27 76.2,41.91 76.2,43.81 74.3,45.72 v74.3,62.23 C31.2 76.2,81.92 v76.2,90.81 | 75.56,38.1 C24.2 | v40.01,85.09 40.64,84.45 v40.64,78.74 40.64,78.11 38.73,76.2 38.73,66.67 39.37,66.04 39.37,61.59 IC11.20 | IC9.16 47.62,57.78 46.99,57.15 46.99,48.26 | 46.99,48.26 46.99,40.64 | 46.99,40.64 46.99,40.01 IC4.14 41.27,34.29 C29.2 | IC4.13 46.99,40.64 | IC4.10 46.99,48.26 | C19.1 130.81,34.29 Q1.3 | JP2.1 v11.43,27.3
  Bottom 1.016: U$1.3A 126.36,120.97 125.73,120.33 125.73,109.54 126.68,108.58 126.68,94.3 v126.36,93.98
  Bottom 1.27: IC21.9 142.88,28.57 143.51,27.94 143.51,12.7 IC7.16 | v212.41,11.11 212.41,38.18 | 212.41,38.18 212.41,71.44 214,73.03 214,75.56 212.72,76.83 R31.1 209.55,78.74 207.01,81.28 C1.+ 201.61,81.28 200.03,82.87 200.03,93.34 | 212.41,38.18 210.26,38.18
  Bottom 1.93: 7805.OUT 208.28,106.68 207.65,106.05 207.65,93.98 207.01,93.34 200.03,93.34 v191.77,93.34 v189.87,93.34
+12V  (via drill 0.6, 0.8)
  Top 0.813: IC11.5 41.27,68.58 v40.01,67.31 | v36.04,55.88 34.13,53.98 v26.67,53.98 | v97.16,123.83 98.9,122.08 102.71,122.08 108.58,116.2 118.11,116.2 118.75,115.57 127.64,115.57 129.54,113.67 131.44,113.67 132.72,112.39 170.81,112.39 v171.45,111.76 | v174.62,120.02 U$1.22B | v36.83,91.44 30.48,91.44 29.21,90.17 24.77,90.17 23.5,88.9 18.47,88.9 L1.2 | v15.24,74.93 12.06,74.93 9.53,72.39 R68.1
  Bottom 0.813: R59.1 17.14,113.67 18.41,112.39 IC12.14 21.59,112.39 | v97.16,123.83 92.08,128.91 83.82,128.91 78.11,123.19 72.39,123.19 71.12,124.46 67.31,124.46 66.04,123.19 C43.2 52.39,123.51 46.99,123.51 45.72,122.24 45.72,110.49 44.45,109.22 42.55,109.22 | IC12.16 20.95,107.31 21.59,107.95 21.59,112.39 | 21.59,112.39 21.59,123.19 23.5,125.09 R58.1 33.66,123.19 33.66,110.49 34.92,109.22 41.27,109.22 | v40.01,67.31 40.64,66.67 40.64,60.33 36.2,55.88 v36.04,55.88 | v26.67,53.98 17.78,53.98 R54.1 15.88,62.23 15.24,62.87 8.57,62.87 7.94,63.5 7.94,67.31 | v171.45,111.76 171.45,116.84 v174.62,120.02 | v36.83,91.44 38.73,91.44 45.09,97.79 45.09,104.78 C53.+ 42.55,109.22 | L1.2 18.39,88.87 14.29,84.77 14.29,81.6 15.24,80.64 v15.24,74.93 | D24.C 7.94,67.31 | 7.94,67.31 R68.1 | 41.27,109.22 42.55,109.22 | R57.1 41.27,114.3 41.27,109.22
+12V_UNREG  (via drill 0.6)
  Top 0.813: v191.13,120.02 191.13,119.38 189.87,118.11 177.8,118.11 177.16,118.75 U$1.23B
  Bottom 0.813: v191.13,120.02 201.93,130.81 210.5,130.81 216.85,124.46 216.85,4.45 213.2,0.79 4.29,0.79 1.27,3.81 1.27,50.16 5.08,53.98 10.79,53.98 C51.1 15.18,53.4 Q6.E Q5.E 15.18,45.78 18.41,42.55 C48.1
-5V  (via drill 0.6, 0.8)
  Top 0.813: v181.61,110.49 167.32,110.49 v167,110.81 | v169.54,120.02 U$1.20B
  Bottom 0.813: D21.A 4.45,33.66 6.35,35.56 | 6.35,35.56 R67.1 | 6.35,35.56 7.3,34.61 C50.1 7.62,34.29 8.89,33.02 8.89,8.26 | 8.89,8.26 8.89,5.71 12.7,1.91 205.1,1.91 212.09,8.89 214.31,8.89 215.58,10.16 215.58,120.65 213.04,123.19 198.75,123.19 186.06,110.49 v181.61,110.49 | v167,110.81 167,117.47 v169.54,120.02 | J3.1 8.89,8.26
/INT  (via drill 0.5)
  Top 0.305: U$1.13B 151.76,120.65 TP10.1 | R25.2 128.27,40.64 129.86,42.23 133.03,42.23 133.35,41.91 149.86,41.91 v151.13,43.18
  Bottom 0.305: TP10.1 153.03,111.76 156.21,108.58 156.21,106.05 155.57,105.41 155.57,96.52 154.94,95.89 154.94,77.47 IC1.16 150.81,73.34 150.81,69.85 150.18,69.22 150.18,47.94 151.13,46.99 v151.13,43.18
A0  (via drill 0.5)
  Top 0.305: IC2.10 198.75,60.96 197.49,59.69 190.5,59.69 189.23,58.42 187.96,58.42 187.32,59.05 182.25,59.05 181.29,58.1 176.53,58.1 175.58,59.05 164.47,59.05 v163.83,58.42 | v163.19,63.5 160.02,63.5 158.75,62.23 148.59,62.23 147.32,63.5 IC1.30 | IC8.3 77.47,68.58 78.74,67.31 v84.45,67.31 | v81.92,107.95 82.55,108.58 89.53,108.58 92.08,106.05 95.25,106.05 95.89,105.41 97.79,105.41 99.69,107.31 118.75,107.31 120.02,108.58 v134.62,108.58 | Q1.2 130.81,37.47 132.72,37.47 133.99,36.2 134.62,36.2 135.25,35.56 v135.89,35.56 136.53,34.92 151.76,34.92 v152.4,34.29
  Bottom 0.305: v163.83,58.42 163.83,59.69 163.19,60.33 v163.19,63.5 | v84.45,67.31 84.45,68.9 83.82,69.53 83.82,74.93 81.92,76.83 81.92,86.36 80.01,88.27 80.01,91.76 76.83,94.93 76.83,100.01 78.74,101.92 78.74,104.78 v81.92,107.95 | U$1.9A 141.6,121.28 141.92,120.97 141.92,115.89 v134.62,108.58 134.62,107.95 138.43,104.14 138.43,99.69 142.24,95.89 142.24,85.72 141.6,85.09 141.6,73.98 140.97,73.34 140.97,66.04 IC1.30 135.25,60.33 135.25,40.96 134.3,40.01 134.3,37.15 v135.89,35.56 | v152.4,34.29 151.76,33.66 151.76,24.77 151.13,24.13 151.13,17.78 IC7.3
A1  (via drill 0.5)
  Top 0.305: IC2.9 200.03,58.42 198.75,57.15 190.18,57.15 v188.91,55.88 | v188.91,35.56 v154.94,35.56 137.16,35.56 v135.25,37.47 | v75.56,104.14 76.83,102.87 80.01,102.87 82.55,100.33 91.44,100.33 92.08,99.69 95.57,99.69 96.2,99.06 99.06,99.06 99.69,99.69 109.54,99.69 110.17,99.06 113.35,99.06 v113.67,99.38 | v113.03,112.39 113.67,112.39 114.94,113.67 127,113.67 130.18,110.49 138.43,110.49 v139.06,109.86 149.22,109.86 152.4,106.68 156.84,106.68 158.12,107.95 163.19,107.95 163.83,107.31 v166.37,107.31 | v202.56,78.11 202.56,78.74 200.66,80.64 198.75,80.64 198.12,81.28 184.78,81.28 181.61,84.45 177.16,84.45 176.53,83.82 v173.99,83.82
  Bottom 0.305: v188.91,55.88 v188.91,35.56 | v154.94,35.56 154.94,25.4 IC7.6 | v135.25,37.47 135.25,40.01 135.89,40.64 135.89,58.42 IC1.31 | IC8.6 69.22,77.47 69.22,81.92 71.75,84.45 72.39,84.45 73.03,85.09 73.03,86.36 74.93,88.27 74.93,103.5 v75.56,104.14 | v113.67,99.38 113.67,111.76 v113.03,112.39 | U$1.10A 144.15,114.94 v139.06,109.86 | v166.37,107.31 168.91,104.78 168.91,95.57 174.62,89.85 174.62,87.63 173.99,87 v173.99,83.82 | IC2.9 203.84,60.96 203.84,76.83 v202.56,78.11
A2  (via drill 0.5)
  Top 0.305: v201.93,33.02 v171.45,33.02 v147.32,33.02 | v144.78,39.37 v137.16,39.37 | IC8.13 58.42,71.12 57.15,72.39 v41.27,72.39 | v36.83,51.44 37.47,51.44 38.73,52.7 39.69,52.7 40.64,51.75 41.59,51.75 42.55,52.7 43.18,52.7 43.81,53.34 43.81,53.98 44.45,54.61 v55.24,54.61 | v54.61,36.2 59.69,36.2 60.96,37.47 71.12,37.47 72.39,36.2 76.83,36.2 77.15,36.51 79.06,36.51 79.38,36.2 81.28,36.2 82.55,37.47 93.03,37.47 94.3,36.2 99.06,36.2 100.97,38.1 103.5,38.1 105.09,39.69 110.49,39.69 110.81,39.37 v111.12,39.37 | v111.76,57.15 132.08,57.15 132.72,56.52 133.99,56.52 135.89,58.42 IC1.32 142.88,58.42 144.15,59.69 v146.69,59.69
  Bottom 0.305: IC2.8 203.84,53.34 203.84,48.9 202.56,47.62 202.56,45.72 201.93,45.09 v201.93,33.02 | v147.32,33.02 144.78,35.56 v144.78,39.37 | v137.16,39.37 137.16,57.15 IC1.32 | v171.45,33.02 171.45,19.68 172.72,18.41 172.72,8.89 172.09,8.26 164.15,8.26 157.8,14.61 156.21,14.61 154.94,13.34 154.94,12.7 154.31,12.06 151.76,12.06 IC7.13 | v41.27,72.39 41.27,72.07 41.59,71.75 41.59,60.01 37.15,55.56 37.15,55.24 36.83,54.93 v36.83,51.44 | v55.24,54.61 54.61,53.98 v54.61,36.2 | v111.12,39.37 111.12,56.52 v111.76,57.15 | U$1.11A 146.69,74.93 147.32,74.3 147.32,60.33 v146.69,59.69
A3  (via drill 0.5)
  Top 0.305: IC2.7 201.29,53.34 200.03,54.61 182.25,54.61 179.71,57.15 165.1,57.15 162.56,54.61 v147.32,54.61 146.69,55.24 143.51,55.24 142.88,55.88 IC1.33 137.79,55.88 136.53,54.61 109.86,54.61 106.68,57.78 106.68,59.69 100.33,66.04 v99.69,66.04 | v99.69,55.24 99.69,54.61 88.27,54.61 87,55.88 v84.45,55.88 | v83.19,77.47 78.74,77.47 77.47,76.2 73.03,76.2 71.75,77.47 v65.41,77.47 | IC7.10 v149.86,26.04
  Bottom 0.305: v99.69,66.04 v99.69,55.24 | v84.45,55.88 84.45,64.77 85.72,66.04 85.72,68.58 84.45,69.85 84.45,76.2 v83.19,77.47 | v65.41,77.47 64.14,77.47 IC8.10 | v147.32,54.61 148.59,55.88 148.59,69.22 147.96,69.85 147.96,74.93 147.32,75.56 147.32,94.61 149.86,97.16 149.86,99.69 149.22,100.33 U$1.12A | v149.86,26.04 149.86,40.01 142.24,47.62 142.24,50.8 140.97,52.07 140.97,52.7 139.7,53.98 139.7,55.24 139.06,55.88 IC1.33
A4  (via drill 0.5)
  Top 0.305: IC2.6 201.29,50.8 200.03,52.07 189.23,52.07 187.64,50.48 v185.42,50.48 | v183.51,34.61 v174.62,34.61 | v174.62,24.77 165.74,24.77 IC6.6 | v60.01,54.61 76.2,54.61 77.47,55.88 v78.42,55.88 | v78.74,62.23 87,62.23 88.27,60.96 v90.17,60.96 | v90.17,52.07 99.69,52.07 v100.33,52.7 | v100.97,61.91 100.97,61.59 110.49,52.07 136.53,52.07 137.79,53.34 IC1.34 | v175.26,72.39 175.9,71.75 189.87,71.75 190.5,72.39 191.77,72.39 193.04,71.12 202.56,71.12 203.84,69.85 207.65,69.85 v208.91,68.58 | v140.97,50.8 144.15,50.8 144.46,50.48 151.76,50.48 152.72,49.53 v161.29,49.53
  Bottom 0.305: v185.42,50.48 183.51,48.58 v183.51,34.61 | v174.62,34.61 v174.62,24.77 | IC9.6 56.52,74.93 56.52,63.5 60.01,60.01 v60.01,54.61 | v78.42,55.88 78.42,56.2 78.74,56.52 v78.74,62.23 | v90.17,60.96 v90.17,52.07 | v100.33,52.7 100.97,53.34 v100.97,61.91 | U$1.24A 179.71,121.6 178.44,120.33 178.44,120.02 174.62,116.2 174.62,111.12 170.18,106.68 170.18,96.2 177.8,88.58 177.8,75.56 175.26,73.03 v175.26,72.39 | v208.91,68.58 208.91,53.34 IC2.6 | IC1.34 v140.97,50.8 | v161.29,49.53 161.29,43.18 162.56,41.91 162.56,39.37 161.93,38.73 161.93,33.66 165.74,29.84 165.74,24.77 IC6.6
A5  (via drill 0.5)
  Top 0.305: IC2.5 205.1,49.53 v201.29,49.53 199.39,49.53 v195.58,45.72 | v194.94,9.53 186.37,9.53 185.9,10 183.67,10 181.29,7.62 179.07,7.62 177.16,9.53 v171.45,9.53 | v201.29,74.3 198.75,74.3 197.49,73.03 196.22,73.03 195.58,73.66 189.87,73.66 186.69,76.83 v176.21,76.83 | v43.81,39.37 46.35,39.37 48.9,36.83 53.34,36.83 53.98,37.47 55.24,37.47 55.88,36.83 59.37,36.83 60.64,38.1 71.75,38.1 73.03,36.83 76.52,36.83 76.83,37.15 79.38,37.15 79.69,36.83 80.64,36.83 81.92,38.1 93.34,38.1 94.61,36.83 98.42,36.83 99.06,37.47 99.06,38.1 97.79,39.37 97.79,40.01 98.42,40.64 100.65,40.64 v100.97,40.96 | IC1.35 137.79,50.8 137.16,50.16 133.35,50.16 v132.72,49.53 | v132.72,46.99 109.22,46.99 105.41,50.8 v105.41,51.44 | IC6.13 155.57,19.68 150.5,19.68 149.86,20.32 v148.59,20.32
  Bottom 0.305: v195.58,45.72 194.94,45.09 194.94,22.86 194.31,22.23 194.31,14.29 194.94,13.65 v194.94,9.53 | v171.45,9.53 163.83,9.53 159.38,13.97 159.38,15.88 IC6.13 | v201.29,49.53 202.25,50.48 202.25,73.34 v201.29,74.3 | v176.21,76.83 176.85,77.47 176.85,88.58 169.54,95.89 169.54,107.31 173.99,111.76 173.99,116.84 177.16,120.02 U$1.23A | IC9.13 45.72,69.22 45.72,58.42 43.81,56.52 43.81,53.34 43.18,52.7 43.18,40.01 v43.81,39.37 | v132.72,49.53 v132.72,46.99 | v105.41,51.44 103.5,49.53 103.5,45.72 102.87,45.09 102.87,42.86 v100.97,40.96 | v148.59,20.32 148.59,40.32 139.7,49.21 139.7,49.53 IC1.35
A6  (via drill 0.5)
  Top 0.305: IC24.14 100.97,18.41 102.23,17.14 107.31,17.14 108.58,18.41 IC22.14 112.39,18.41 113.67,17.14 119.38,17.14 120.65,18.41 IC23.14 125.09,18.41 126.36,17.14 131.44,17.14 132.72,18.41 IC21.14 136.53,18.41 137.79,17.14 v140.34,17.14 166.37,17.14 167.64,18.41 IC5.12 170.81,18.41 172.09,19.68 182.25,19.68 182.88,20.32 v184.78,20.32 | IC2.4 199.39,45.72 198.12,44.45 v184.78,44.45 | IC9.10 52.07,78.74 53.34,80.01 57.15,80.01 57.47,79.69 58.1,79.69 58.42,80.01 71.75,80.01 73.03,78.74 77.15,78.74 78.42,80.01 v83.19,80.01 | v83.19,114.3 83.19,114.94 82.55,115.57 82.55,116.52 83.19,117.16 93.66,117.16 94.61,116.2 106.05,116.2 111.12,111.12 114.3,111.12 115.57,112.39 126.36,112.39 128.91,109.86 135.89,109.86 v136.53,109.22 137.16,108.58 149.22,108.58 151.76,106.05 157.16,106.05 158.43,107.31 162.88,107.31 164.15,106.05 167.64,106.05 v168.28,106.68 | v143.51,48.26 IC1.36
  Bottom 0.305: v184.78,44.45 v184.78,20.32 | v140.34,17.14 139.06,18.41 139.06,29.84 139.7,30.48 139.7,33.66 142.24,36.2 142.24,44.45 IC1.36 | v83.19,80.01 83.19,86.36 80.64,88.9 80.64,92.08 77.47,95.25 77.47,99.69 80.64,102.87 80.64,104.78 83.19,107.31 v83.19,114.3 | v168.28,106.68 168.28,107.95 170.18,109.86 170.18,116.84 173.35,120.02 173.35,120.33 174.62,121.6 U$1.22A | v136.53,109.22 136.53,107.95 139.06,105.41 139.06,100.01 142.88,96.2 142.88,85.09 142.24,84.45 142.24,73.66 141.6,73.03 141.6,52.7 143.51,50.8 v143.51,48.26
A7  (via drill 0.5)
  Top 0.305: v206.38,21.59 205.74,22.23 190.82,22.23 188.28,19.68 186.06,19.68 184.78,18.41 IC26.12 | v173.99,36.83 170.81,36.83 170.18,36.2 165.1,36.2 164.47,36.83 v140.97,36.83 | IC8.2 v77.15,66.04 | v77.79,80.96 79.38,82.55 100.97,82.55 101.6,83.19 106.68,83.19 107.31,82.55 123.19,82.55 v123.51,82.23 | v124.46,69.85 131.44,69.85 133.99,72.39 v142.88,72.39 144.15,71.12 v149.22,71.12 | v153.03,107.95 153.67,107.31 156.53,107.31 157.8,108.58 v164.47,108.58 | IC1.37 v147.32,45.72
  Bottom 0.305: IC1.37 139.7,45.72 140.97,44.45 v140.97,36.83 | IC2.3 205.1,41.91 205.1,37.47 207.01,35.56 207.01,28.26 207.33,27.94 207.33,22.54 v206.38,21.59 | IC26.12 179.07,18.41 178.44,19.05 178.44,32.38 v173.99,36.83 | v77.15,66.04 76.83,66.36 76.83,71.75 78.11,73.03 78.11,80.33 77.79,80.64 v77.79,80.96 | v123.51,82.23 123.83,81.92 123.83,70.48 v124.46,69.85 | v149.22,71.12 149.22,75.25 149.54,75.56 149.54,76.83 149.22,77.15 149.22,80.01 150.5,81.28 150.5,88.9 152.4,90.81 152.4,107.31 v153.03,107.95 | v164.47,108.58 165.42,109.54 167.32,109.54 168.28,110.49 168.28,117.16 170.81,119.7 170.81,120.33 172.09,121.6 U$1.21A | v147.32,45.72 146.05,46.99 146.05,49.53 142.24,53.34 142.24,71.75 v142.88,72.39
A7'
  Top 0.305: IC24.10 99.38,28.57 99.69,28.26 101.28,28.26 102.23,27.3 107.31,27.3 108.58,28.57 IC22.10 110.17,28.57 110.49,28.26 112.71,28.26 113.67,27.3 119.38,27.3 120.65,28.57 IC23.10 124.14,28.57 124.46,28.26 125.41,28.26 126.36,27.3 131.44,27.3 132.72,28.57 IC21.10 134.62,28.57 134.94,28.26 137.48,28.26 138.43,27.3 177.8,27.3 179.07,28.57 IC26.8
A8  (via drill 0.5)
  Top 0.305: v67.94,64.77 v87.95,64.77 | v88.27,46.99 102.87,46.99 106.68,43.18 110.49,43.18 111.76,41.91 128.27,41.91 129.54,43.18 IC1.38 149.22,43.18 150.5,44.45 v156.21,44.45 v162.56,44.45 181.61,44.45 182.88,45.72 IC2.25 | U$1.26B 184.78,120.65 v185.42,120.02 | v176.53,107.31 175.9,107.95 167,107.95 165.1,109.86 158.12,109.86 156.53,108.27 v154.94,108.27 | v151.13,79.69 151.45,80.01 163.83,80.01 v164.47,80.64
  Bottom 0.305: IC8.5 69.22,72.39 69.22,66.04 v67.94,64.77 | v87.95,64.77 88.27,64.45 v88.27,46.99 | v185.42,120.02 185.42,119.38 182.25,116.2 180.02,116.2 177.8,113.98 177.8,108.58 v176.53,107.31 | v154.94,108.27 154.94,106.05 153.67,104.78 153.67,90.81 151.13,88.27 v151.13,79.69 | v164.47,80.64 165.1,80.01 165.1,67.31 161.93,64.14 161.93,59.69 162.56,59.05 162.56,57.15 163.83,55.88 D2.C 162.56,52.07 v162.56,44.45 | IC7.5 155.57,23.5 155.57,31.75 156.21,32.38 v156.21,44.45
A8-1  (via drill 0.5)
  Top 0.305: IC24.7 107.31,23.5 108.58,24.77 112.39,24.77 113.67,23.5 IC22.7 119.38,23.5 120.65,24.77 125.09,24.77 126.36,23.5 IC23.7 131.44,23.5 132.72,24.77 136.53,24.77 137.79,23.5 IC21.7 143.51,23.5 144.78,22.23 v152.08,22.23
  Bottom 0.305: IC7.7 153.03,25.08 151.76,23.81 151.76,22.54 v152.08,22.23
A9  (via drill 0.5)
  Top 0.305: v172.72,34.29 v163.19,34.29 | v163.83,46.99 182.88,46.99 184.15,48.26 IC2.24 | v163.83,41.91 153.03,41.91 151.76,40.64 IC1.39 | v177.16,102.87 170.81,102.87 168.91,104.78 v163.19,104.78 161.29,104.78 160.02,103.5 151.13,103.5 150.5,104.14 140.97,104.14 140.02,105.09 135.25,105.09 133.99,103.82 126.68,103.82 124.46,106.05 111.12,106.05 109.86,104.78 99.06,104.78 95.25,100.97 93.98,100.97 91.44,103.5 81.92,103.5 80.64,104.78 77.15,104.78 74.61,107.31 v67.31,107.31
  Bottom 0.305: IC7.14 152.4,8.89 158.12,8.89 160.97,6.03 171.77,6.03 173.35,7.62 173.35,19.05 172.72,19.68 v172.72,34.29 | v163.19,34.29 163.19,41.27 v163.83,41.91 v163.83,46.99 163.83,50.8 D3.C 167.64,54.61 167.64,57.78 164.47,60.96 164.47,62.23 165.74,63.5 166.37,63.5 167.64,64.77 167.64,86.36 164.47,89.53 164.47,93.98 162.56,95.89 162.56,99.69 163.19,100.33 v163.19,104.78 | U$1.27A 187.32,121.28 186.69,120.65 186.69,119.7 182.56,115.57 180.34,115.57 178.44,113.67 178.44,106.36 177.16,105.09 v177.16,102.87 | IC8.14 67.31,73.03 67.31,101.6 66.04,102.87 66.04,103.5 67.31,104.78 v67.31,107.31
A9-2  (via drill 0.5)
  Top 0.305: IC21.8 137.79,26.04 136.53,27.3 132.72,27.3 131.44,26.04 IC23.8 126.36,26.04 125.09,27.3 120.65,27.3 119.38,26.04 IC22.8 113.67,26.04 112.39,27.3 108.58,27.3 107.31,26.04 IC24.8 | v140.34,22.23 142.88,22.23 144.15,20.95 IC7.12
  Bottom 0.305: IC21.8 140.34,24.77 v140.34,22.23
A10  (via drill 0.5)
  Top 0.305: v193.04,49.53 189.23,49.53 188.59,48.9 183.2,48.9 182.56,49.53 174.62,49.53 173.99,50.16 167,50.16 D4.C | v187.96,120.02 187.32,120.65 U$1.27B | IC7.11 149.86,23.5 151.13,24.77 v160.02,24.77 | IC1.40 139.38,38.1 139.7,38.42 141.6,38.42 141.92,38.1 150.5,38.1 151.76,39.37 v157.48,39.37 v165.1,39.37 | v107.31,44.45 106.68,44.45 101.6,49.53 v89.53,49.53 | v88.9,74.93 66.04,74.93 64.77,76.2 IC8.11
  Bottom 0.305: v193.04,49.53 193.04,54.61 191.77,55.88 IC2.21 193.99,58.74 193.99,62.87 193.04,63.82 193.04,72.07 191.77,73.34 191.77,80.64 176.85,95.57 176.85,98.11 177.8,99.06 177.8,99.69 178.44,100.33 178.44,105.41 179.07,106.05 179.07,113.35 180.66,114.94 182.88,114.94 v187.96,120.02 | v160.02,24.77 160.02,27.3 157.48,29.84 v157.48,39.37 | v165.1,39.37 165.1,49.53 D4.C | IC1.40 138.43,29.84 137.79,29.21 137.79,17.14 139.06,15.88 139.7,15.88 139.7,8.26 135.89,4.45 106.68,4.45 104.78,6.35 104.78,29.21 105.41,29.84 106.05,29.84 107.95,31.75 107.95,35.56 107,36.51 107,44.13 v107.31,44.45 | v89.53,49.53 88.9,50.16 v88.9,74.93
A10-3  (via drill 0.5)
  Top 0.305: IC24.11 100.01,26.04 101.92,24.13 102.87,24.13 103.5,24.77 107.31,24.77 108.58,26.04 IC22.11 112.39,26.04 113.67,24.77 119.38,24.77 120.65,26.04 IC23.11 125.09,26.04 126.36,24.77 131.44,24.77 132.72,26.04 IC21.11 136.53,26.04 137.79,24.77 v147.32,24.77
  Bottom 0.305: v147.32,24.77 147.32,26.67 IC7.9
A11  (via drill 0.5)
  Top 0.305: IC2.23 189.23,50.8 187.96,49.53 183.51,49.53 v182.25,50.8 | v182.25,36.83 175.26,36.83 173.99,38.1 170.81,38.1 169.86,37.15 167.32,37.15 D5.C IC1.1 152.4,38.1 151.76,37.47 141.6,37.47 141.29,37.78 140.34,37.78 139.38,36.83 137.79,36.83 135.89,38.73 131.44,38.73 130.49,39.69 129.22,39.69 128.27,38.73 128.27,38.1 127,36.83 113.03,36.83 112.39,37.47 110.49,37.47 109.22,38.73 v105.41,38.73 | v99.69,24.77 v89.53,24.77 | v91.44,71.12 90.17,72.39 66.04,72.39 63.5,74.93 60.96,74.93 59.69,73.66 IC9.5 | v179.71,104.14 v171.45,104.14
  Bottom 0.305: v182.25,36.83 v182.25,50.8 182.25,56.83 185.42,60.01 185.42,64.77 184.78,65.41 184.78,82.87 170.81,96.84 170.81,100.33 171.45,100.97 v171.45,104.14 | IC6.5 167,23.5 167,29.84 166.37,30.48 D5.C | v105.41,38.73 105.41,36.83 107.31,34.92 107.31,33.02 106.68,32.38 104.78,32.38 104.14,31.75 104.14,25.4 102.87,24.13 100.33,24.13 v99.69,24.77 | v89.53,24.77 90.81,26.04 90.81,27.94 89.53,29.21 89.53,32.38 90.81,33.66 90.81,41.91 92.08,43.18 92.08,65.41 91.44,66.04 v91.44,71.12 | U$1.28A 189.87,120.02 184.15,114.3 180.97,114.3 179.71,113.03 v179.71,104.14
A11-4  (via drill 0.5)
  Top 0.305: IC24.12 100.97,23.5 102.23,22.23 107.31,22.23 108.58,23.5 IC22.12 112.39,23.5 113.67,22.23 119.38,22.23 120.65,23.5 IC23.12 125.09,23.5 126.36,22.23 131.44,22.23 132.72,23.5 IC21.12 | v137.16,12.7 137.79,12.06 153.67,12.06 156.21,14.61 v163.19,14.61
  Bottom 0.305: IC21.12 135.89,23.5 137.16,22.23 137.16,16.83 138.11,15.88 138.11,13.65 v137.16,12.7 | v163.19,14.61 163.19,24.77 IC6.7
A12  (via drill 0.5)
  Top 0.305: IC2.2 201.93,40.64 200.66,39.37 v198.12,39.37 174.62,39.37 173.35,40.64 D6.C v161.29,40.64 IC1.2 | v181.61,97.16 180.66,98.11 176.21,98.11 173.99,100.33 171.77,100.33 170.5,99.06 149.86,99.06 148.59,100.33 v124.46,100.33 123.51,101.28 119.7,101.28 116.84,98.42 110.49,98.42 109.22,97.16 98.42,97.16 97.16,98.42 95.89,98.42 95.25,99.06 82.55,99.06 81.28,100.33 73.66,100.33 v73.03,100.97 | v67.94,68.58 65.41,68.58 64.14,69.85 53.34,69.85 52.07,68.58 IC9.14 | v161.29,15.88 IC6.14